# EAGLE design tweeq-Stamp_IMU_6DOF_v4 (EAGLE 7.2.0)
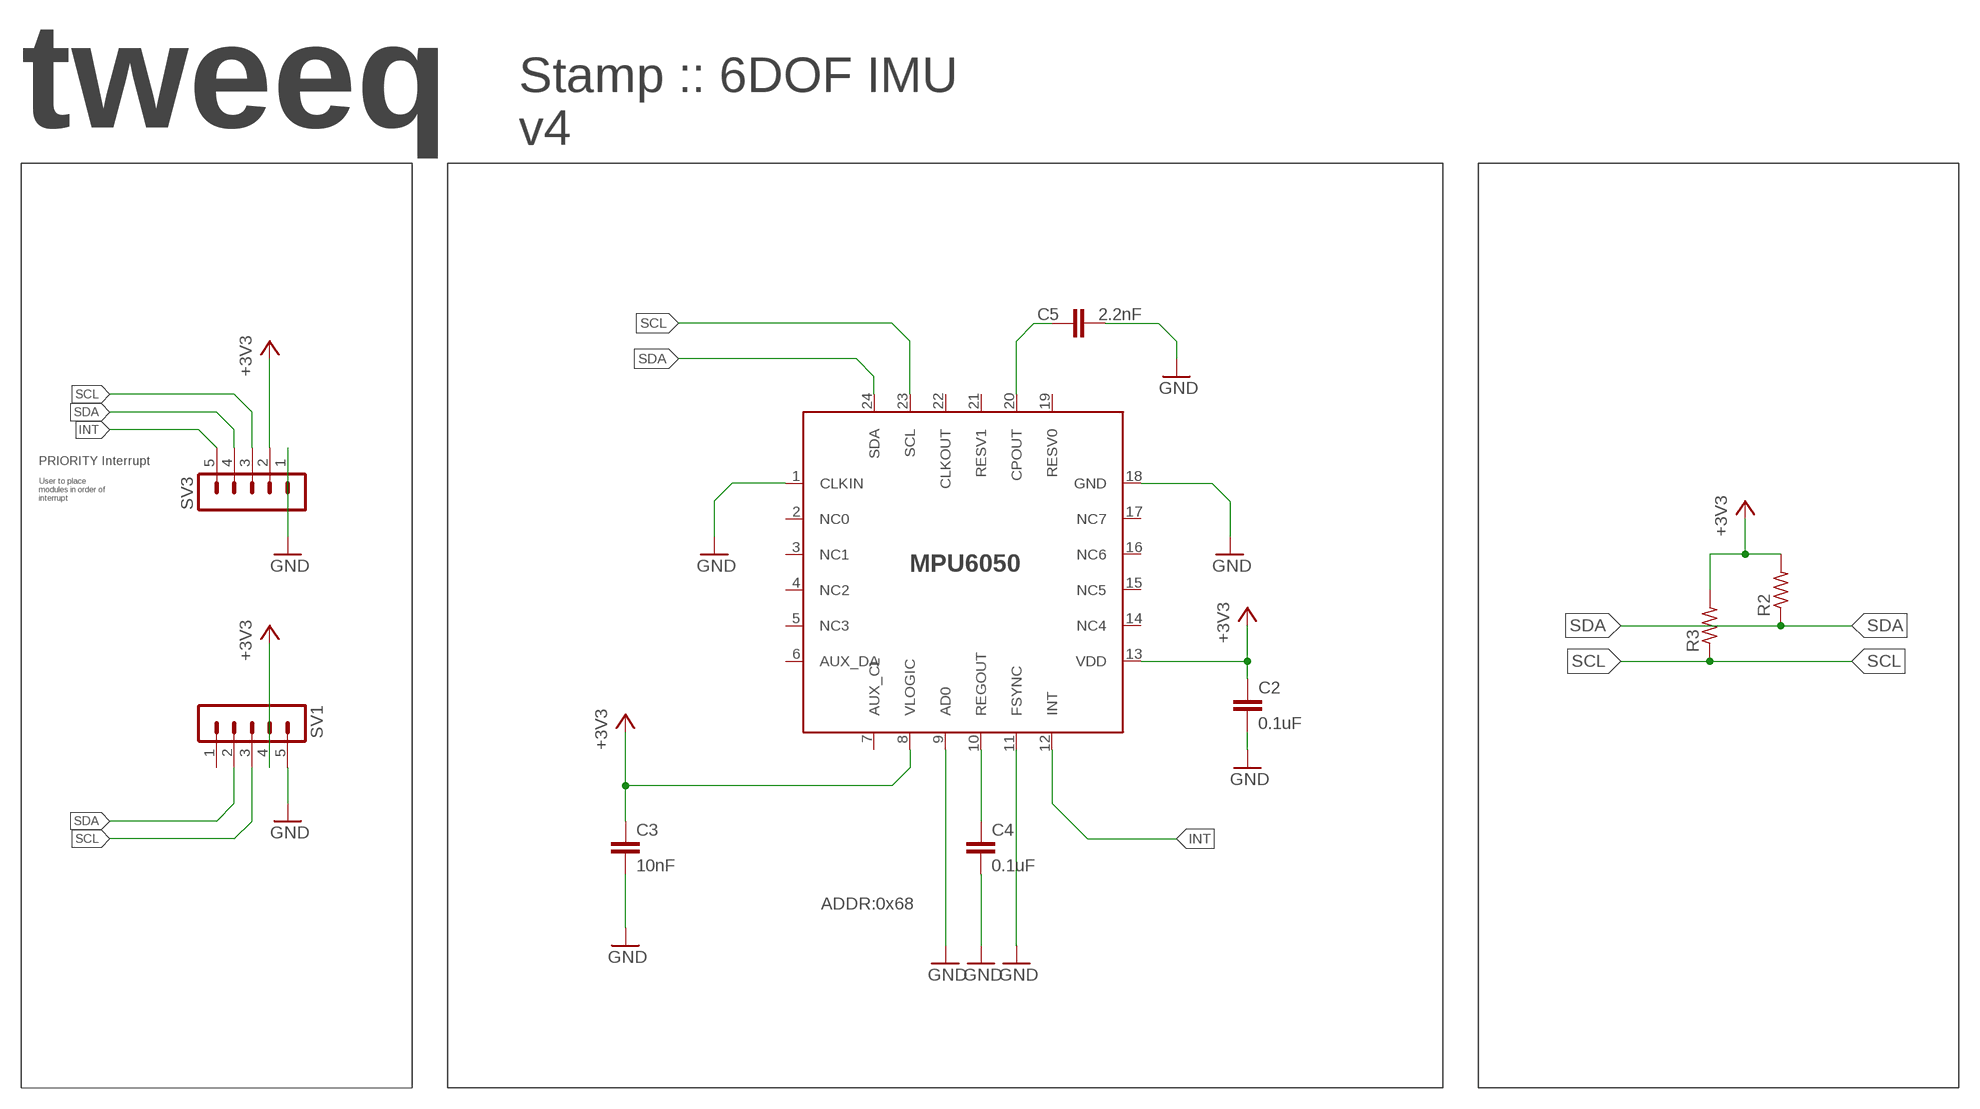
[diagram p0: schematic, sheet 1]

## Parts
C2  0.1uF  C-EUC0603K  [C0603K]
C3  10nF  C-EUC0603K  [C0603K]
C4  0.1uF  C-EUC0603K  [C0603K]
C5  2.2nF  C-EUC0603K  [C0603K]
R2  R-US_R0603  [R0603]
R3  R-US_R0603  [R0603]
SV1  M05-1STAMP  [1X05-1.5MM-STAMP]
SV3  M05-1STAMP  [1X05-1.5MM-STAMP]
U1  MPU6050  [QFN24]

## Nets
+3V3: C2.1 C3.1 R2.2 R3.2 SV1.4 SV3.2 U1.8(VLOGIC) U1.13(VDD)
GND: C2.2 C3.2 C4.2 C5.2 SV1.5 SV3.1 U1.1(CLKIN) U1.9(AD0) U1.11(FSYNC) U1.18(GND)
INT: SV3.5 U1.12(INT)
N$4: C5.1 U1.20(CPOUT)
N$6: C4.1 U1.10(REGOUT)
SCL: R3.1 SV1.3 SV3.3 U1.23(SCL)
SDA: R2.1 SV1.2 SV3.4 U1.24(SDA)
Unconnected: SV1.1 U1.2(NC0) U1.3(NC1) U1.4(NC2) U1.5(NC3) U1.6(AUX_DA) U1.7(AUX_CL) U1.14(NC4) U1.15(NC5) U1.16(NC6) U1.17(NC7) U1.19(RESV0) U1.21(RESV1) U1.22(CLKOUT)

## Notes on the sheet
- FUNcBoard: mOLED + EEPROM
- tweeq | V5
- Stamp :: 6DOF IMU 
  v4
- PRIORITY Interrupt
- User to place 
  modules in order of 
  interrupt
- MPU6050
- ADDR:0x68

## Library data of the parts
C2-C5 = AISCube:C-EU: CAPACITOR, European symbol
R2 R3 = AISCube:R-US_: RESISTOR, American symbol
SV1 SV3 = AISCube:M05-1: PIN HEADER Standard 0.1" header pin 5 pins - 1 way
U1 = AISCube:MPU6050

## Board
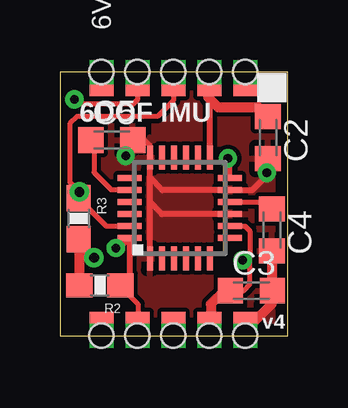
[diagram p1: board, top side]
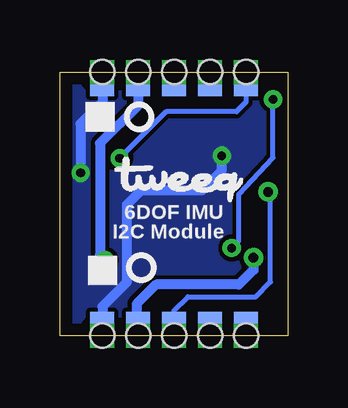
[diagram p2: board, bottom side, seen from below]

Size 9.5 x 11 mm. Coordinates in mm from the lower left corner, seen from the top.
Outline: 9.5,11 0,11 0,0 9.5,0 9.5,11
Copper layers (1*16): Top 0.0356mm / dielectric 1.5011mm / Bottom 0.0356mm
Design rules "AISCube": minimum track width 7mil, minimum drill 14mil, track to track 7mil, track to pad 7mil, pad to pad 7mil, via to via 7mil, smd to smd 0mil, copper to edge 20mil, drill to drill 8mil, minimum pad ring 10mil, minimum via ring 8mil, stop-mask expansion 4mil, vias tented up to drill 32mil, thermal gap 10mil

### Footprints (pad centres in the part's own frame; a part is rotated, then mirrored left to right if it is on the bottom)
C0603K = smd 1.05 x 1.08: 1 -0.875,0; 2 0.875,0
R0603 = smd 1.1 x 1: 1 -0.85,0; 2 0.85,0
1X05-1.5MM-STAMP = drill 0.5 pad 1 square: 1 -3,0; 2 -1.5,0; 3 0,0; 4 1.5,0; 5 3,0 | smd 1 x 0.6: P$1 -3,0.7; P$2 -1.5,0.7; P$3 0,0.7; P$4 1.5,0.7; P$5 3,0.7 | smd 1 x 0.6 bottom: P$6 -3,0.7; P$7 -1.5,0.7; P$8 0,0.7; P$9 1.5,0.7; P$10 3,0.7 | hole 1: -3,0; -1.5,0; 0,0; 1.5,0; 3,0
QFN24 = smd 1 x 0.25: 1 -2.1,1.25; 2 -2.1,0.75; 3 -2.1,0.25; 4 -2.1,-0.25; 5 -2.1,-0.75; 6 -2.1,-1.25; 13 2.1,-1.25; 14 2.1,-0.75; 15 2.1,-0.25; 16 2.1,0.25; 17 2.1,0.75; 18 2.1,1.25 | smd 0.25 x 1: 7 -1.25,-2.1; 8 -0.75,-2.1; 9 -0.25,-2.1; 10 0.25,-2.1; 11 0.75,-2.1; 12 1.25,-2.1; 19 1.25,2.1; 20 0.75,2.1; 21 0.25,2.1; 22 -0.25,2.1; 23 -0.75,2.1; 24 -1.25,2.1

### Placement (x,y rotation side)
C2  8.68,8.27 270 top
C3  7.99,1.88 0 top
C4  8.84,4.41 270 top
C5  2.16,8.16 0 top
R2  1.67,2.1 180 top
R3  0.78,4.88 270 top
SV1  4.74,0 0 top
SV3  4.74,11 180 top
U1  5,5.32 90 top
U$1  [TWEEQ-LOGO-S]  7.21,5.57 0 bottom

### Tracks (layer width: path | path; a pad name or v marks a point on that pad's centre or on a via)
+3V3  (via drill 0.36, 0.41)
  Top 0.203: U1.8 7.72,4.58 7.92,4.37 7.92,3.45 | 7.92,3.45 v7.62,3.15 | C3.1 7.67,1.88 7.92,2.13 7.92,3.45
  Top 0.254: U1.13 6.25,9.89 6.2,9.94
  Top 0.406: SV3.2 6.2,10.96 6.2,9.94 6.6,9.53 8.29,9.53 C2.1 | v1.42,3.25 0.78,3.89 R3.2 0.82,4 R2.2 | C3.1 6.86,1.88 6.3,1.32 6.3,0.07 SV1.4
  Bottom 0.406: SV3.2 6.25,10.98 6.25,9.6 7.82,8.03 7.82,3.35 v7.62,3.15 | v1.42,3.25 1.42,2.74 2.03,2.13 5.49,2.13 6.3,1.32 6.3,0.07 SV1.4
GND  (via drill 0.36)
  Top 0.203: U1.18 3.76,7.43 3.76,7.92 3.53,8.16 C5.2 3.04,7.8 v2.74,7.5
  Top 0.254: U1.1 3.75,5.57 | 3.75,5.57 3.75,6.59 | 3.75,6.59 U1.18 | 3.75,6.59 4.26,6.08 U1.11 8.02,6.08 8.64,6.69 v8.64,6.79 | U1.9 4.25,5.08 3.75,5.57
  Top 0.406: 8.57,3.84 C4.2 8.84,1.9 C3.2 8.84,1.85 8.84,1.32 8.05,0.53 8.05,0.32 SV1.5 | C2.2 8.68,6.94 v8.64,6.79
  Bottom 0.406: v2.74,7.5 2.74,6.89 3.56,6.08 6.1,6.08 6.71,5.46 6.71,2.23 7.72,1.22 7.72,0.01 SV1.5 | SV3.1 7.74,10.36 7.72,10.35 7.72,9.75 8.64,8.84 v8.64,6.79
  pour Bottom: 0.09,10.85 9.34,10.85 9.34,0.11 0.09,0.11
  pour Top: 0.1,10.86 9.35,10.86 9.35,0.1 0.1,0.1
INT  (via drill 0.36)
  Top 0.203: U1.12 7.1,7.31 v7.01,7.4
  Bottom 0.203: SV3.5 1.74,9.75 2.13,9.35 5.06,9.35 v7.01,7.4
N$4
  Top 0.203: C5.1 1.42,7.92 1.42,6.81 2.13,6.1 2.88,6.1 U1.20
N$6
  Top 0.203: U1.10 8.55,5.58 C4.1
SCL  (via drill 0.41)
  Top 0.203: SV3.3 4.74,9.81 4.06,9.14 0.71,9.14 0.41,8.84 0.41,6.4 v0.81,5.99 0.81,5.76 R3.1 1.13,5.38 1.13,5.37 1.93,4.57 U1.23
  Bottom 0.203: SV1.3 4.74,1.06 4.17,1.63 1.32,1.63 0.71,2.23 0.71,5.89 v0.81,5.99
SDA  (via drill 0.36)
  Top 0.203: v2.34,3.66 2.48,3.66 U1.24 | SV3.4 3.23,9.84 3.05,9.65 0.81,9.65 v0.61,9.86 | R2.1 2.52,2.05 3.25,1.32 3.25,0.02 SV1.2
  Top 0.254: U1.24 2.9,2.28 R2.1
  Bottom 0.203: v2.34,3.66 2.03,3.96 2.03,5.89 0.61,7.42 v0.61,9.86

### Text on the board
tPlace: 6DOF IMU | v4
bPlace: 6DOF IMU | I2C Module
tNames: 6V-9V DC | ON
bNames: Breadboard | V-Reg | Module